# EAGLE design mic_adapter (EAGLE 7.6.0)
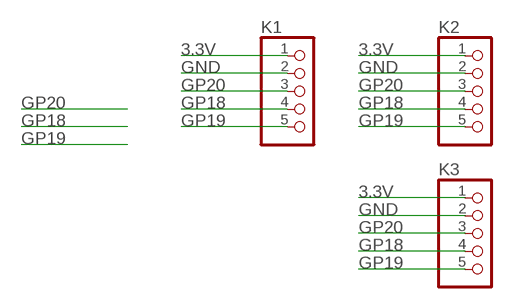
[diagram p0: schematic, sheet 1]

## Parts
K1  HEADER-1X5SMT  [1X05_SMT]
K2  HEADER-1X5SMT  [1X05_SMT]
K3  HEADER-1X5SMT  [1X05_SMT]

## Nets
3.3V: K1.1 K2.1 K3.1
GND: K1.2 K2.2 K3.2
GP18: K1.4 K2.4 K3.4
GP19: K1.5 K2.5 K3.5
GP20: K1.3 K2.3 K3.3

## Library data of the parts
K1-K3 = twomey:HEADER-1X5: PIN HEADER

## Net classes
0 default: clearance 0.205 mm

## Board
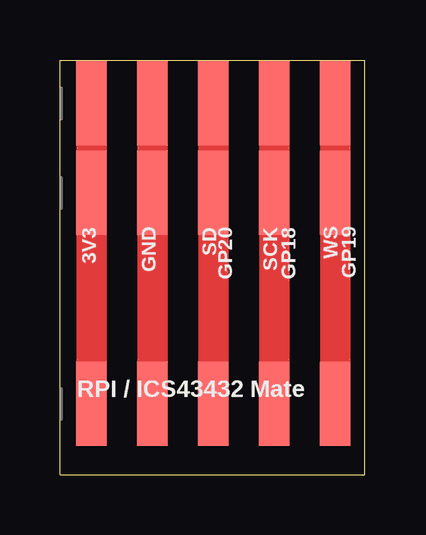
[diagram p1: board, top side]

Size 12.7 x 17.27 mm. Coordinates in mm from the lower left corner, seen from the top.
Outline: 0,0 0,17.27 12.7,17.27 12.7,0 0,0
Copper layers (1*16): Top 0.035mm / dielectric 1.5mm / Bottom 0.035mm
Design rules "default *": minimum track width 8mil, minimum drill 24mil, track to track 4mil, track to pad 4mil, pad to pad 8mil, via to via 8mil, smd to smd 8mil, copper to edge 12mil, drill to drill 8mil, minimum pad ring 10mil, minimum via ring 8mil, stop-mask expansion 4mil, vias tented up to drill 0mil, thermal gap 10mil

### Footprints (pad centres in the part's own frame; a part is rotated, then mirrored left to right if it is on the bottom)
1X05_SMT = smd 1.27 x 3.5: 1 -5.08,0; 2 -2.54,0; 3 0,0; 4 2.54,0; 5 5.08,0

### Placement (x,y rotation side)
K1  6.4,11.73 0 top
K2  6.4,15.47 0 top
K3  6.4,2.95 0 top

### Tracks (layer width: path | path; a pad name or v marks a point on that pad's centre or on a via)
3.3V
  Top 0.406: 1.27,16.03 K2.1
  Top 1.27: K2.1 K1.1 K3.1
GND
  Top 0.406: 3.81,12.19 K1.2
  Top 1.27: K2.2 K1.2 K3.2
GP18
  Top 0.406: 8.97,11.81 K1.4
  Top 1.27: K2.4 K1.4 K3.4
GP19
  Top 0.406: 11.43,12.19 K1.5
  Top 1.27: K2.5 K1.5 K3.5
GP20
  Top 0.406: 6.35,12.19 K1.3
  Top 1.27: K2.3 K1.3 K3.3

### Text on the board
tPlace: 3V3 | GND | SD | GP20 | SCK | GP18 | WS | GP19 | RPI / ICS43432 Mate